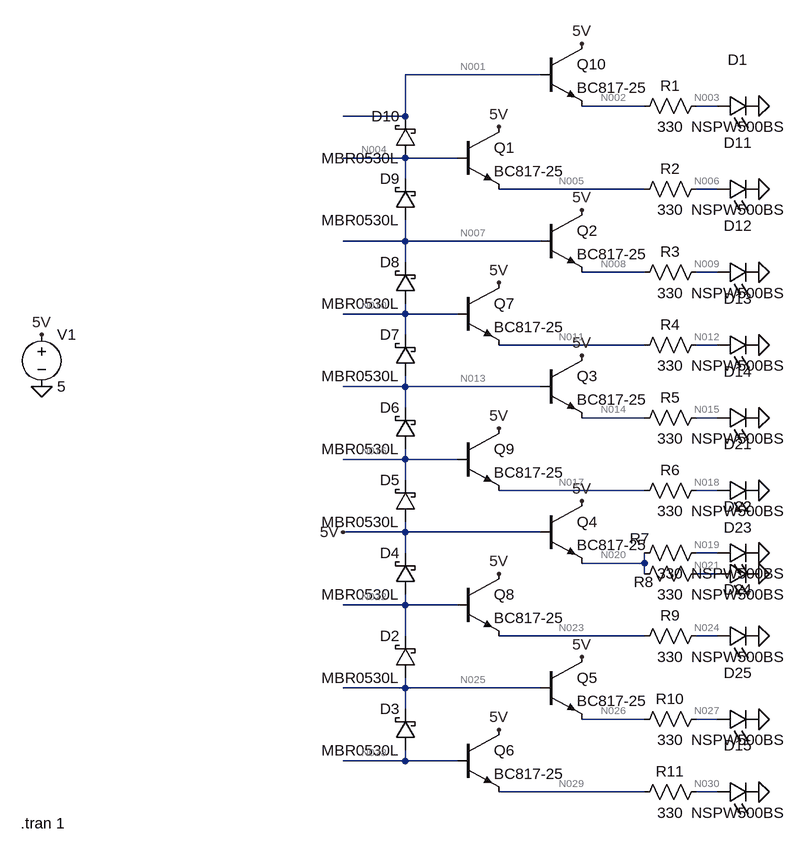
[diagram p0: schematic bargraph-bjt.asc]
bargraph-bjt.asc, the LTspice schematic file:
Version 4
SHEET 1 956 680
WIRE 448 -736 240 -736
WIRE 608 -688 512 -688
WIRE 720 -688 688 -688
WIRE 240 -672 240 -736
WIRE 240 -672 144 -672
WIRE 240 -608 144 -608
WIRE 320 -608 240 -608
WIRE 240 -576 240 -608
WIRE 608 -560 384 -560
WIRE 720 -560 688 -560
WIRE 240 -480 240 -512
WIRE 240 -480 144 -480
WIRE 448 -480 240 -480
WIRE 240 -448 240 -480
WIRE 608 -432 512 -432
WIRE 720 -432 688 -432
WIRE 240 -368 240 -384
WIRE 240 -368 144 -368
WIRE 320 -368 240 -368
WIRE 240 -336 240 -368
WIRE 608 -320 384 -320
WIRE 720 -320 688 -320
WIRE 240 -256 240 -272
WIRE 240 -256 144 -256
WIRE 448 -256 240 -256
WIRE 240 -224 240 -256
WIRE 608 -208 512 -208
WIRE 720 -208 688 -208
WIRE 240 -144 240 -160
WIRE 240 -144 144 -144
WIRE 320 -144 240 -144
WIRE 240 -112 240 -144
WIRE 608 -96 384 -96
WIRE 720 -96 688 -96
WIRE 240 -32 240 -48
WIRE 240 -32 144 -32
WIRE 448 -32 240 -32
WIRE 240 0 240 -32
WIRE 720 0 688 0
WIRE 608 16 608 0
WIRE 608 16 512 16
WIRE 608 32 608 16
WIRE 720 32 688 32
WIRE 240 80 240 64
WIRE 240 80 144 80
WIRE 320 80 240 80
WIRE 240 128 240 80
WIRE 608 128 384 128
WIRE 720 128 688 128
WIRE 240 208 240 192
WIRE 240 208 144 208
WIRE 448 208 240 208
WIRE 240 240 240 208
WIRE 608 256 512 256
WIRE 720 256 688 256
WIRE 240 320 240 304
WIRE 240 320 144 320
WIRE 320 320 240 320
WIRE 608 368 384 368
WIRE 720 368 688 368
FLAG 512 -784 5V
FLAG 384 -656 5V
FLAG 512 -528 5V
FLAG 384 -416 5V
FLAG 512 -304 5V
FLAG 384 -192 5V
FLAG 512 -80 5V
FLAG 384 32 5V
FLAG 512 160 5V
FLAG 384 272 5V
FLAG -320 -336 5V
FLAG -320 -256 0
FLAG 784 -688 0
FLAG 784 -560 0
FLAG 784 -432 0
FLAG 784 -320 0
FLAG 784 -208 0
FLAG 784 -96 0
FLAG 784 0 0
FLAG 784 32 0
FLAG 784 128 0
FLAG 784 256 0
FLAG 784 368 0
FLAG 144 -32 5V
SYMBOL schottky 256 64 R180
WINDOW 0 24 64 Left 2
WINDOW 3 24 0 Left 2
SYMATTR InstName D4
SYMATTR Value MBR0530L
SYMATTR Description Diode
SYMATTR Type diode
SYMBOL npn 320 -416 R0
SYMATTR InstName Q7
SYMATTR Value BC817-25
SYMBOL npn 448 -784 R0
SYMATTR InstName Q10
SYMATTR Value BC817-25
SYMBOL voltage -320 -352 R0
WINDOW 123 0 0 Left 0
WINDOW 39 0 0 Left 0
SYMATTR InstName V1
SYMATTR Value 5
SYMBOL res 704 -704 R90
WINDOW 0 0 56 VBottom 2
WINDOW 3 32 56 VTop 2
SYMATTR InstName R1
SYMATTR Value 330
SYMBOL res 704 -576 R90
WINDOW 0 0 56 VBottom 2
WINDOW 3 32 56 VTop 2
SYMATTR InstName R2
SYMATTR Value 330
SYMBOL res 704 -448 R90
WINDOW 0 0 56 VBottom 2
WINDOW 3 32 56 VTop 2
SYMATTR InstName R3
SYMATTR Value 330
SYMBOL res 704 -336 R90
WINDOW 0 0 56 VBottom 2
WINDOW 3 32 56 VTop 2
SYMATTR InstName R4
SYMATTR Value 330
SYMBOL res 704 -224 R90
WINDOW 0 0 56 VBottom 2
WINDOW 3 32 56 VTop 2
SYMATTR InstName R5
SYMATTR Value 330
SYMBOL res 704 -112 R90
WINDOW 0 0 56 VBottom 2
WINDOW 3 32 56 VTop 2
SYMATTR InstName R6
SYMATTR Value 330
SYMBOL res 704 -16 R90
WINDOW 0 9 103 VBottom 2
WINDOW 3 32 56 VTop 2
SYMATTR InstName R7
SYMATTR Value 330
SYMBOL res 704 16 R90
WINDOW 0 44 97 VBottom 2
WINDOW 3 32 56 VTop 2
SYMATTR InstName R8
SYMATTR Value 330
SYMBOL res 704 112 R90
WINDOW 0 0 56 VBottom 2
WINDOW 3 32 56 VTop 2
SYMATTR InstName R9
SYMATTR Value 330
SYMBOL res 704 240 R90
WINDOW 0 0 56 VBottom 2
WINDOW 3 32 56 VTop 2
SYMATTR InstName R10
SYMATTR Value 330
SYMBOL res 704 352 R90
WINDOW 0 0 56 VBottom 2
WINDOW 3 32 56 VTop 2
SYMATTR InstName R11
SYMATTR Value 330
SYMBOL LED 720 -672 R270
WINDOW 0 72 32 VTop 2
WINDOW 3 0 32 VBottom 2
SYMATTR InstName D1
SYMATTR Value NSPW500BS
SYMBOL LED 720 -544 R270
WINDOW 0 72 32 VTop 2
WINDOW 3 0 32 VBottom 2
SYMATTR InstName D11
SYMATTR Value NSPW500BS
SYMBOL LED 720 -416 R270
WINDOW 0 72 32 VTop 2
WINDOW 3 0 32 VBottom 2
SYMATTR InstName D12
SYMATTR Value NSPW500BS
SYMBOL LED 720 -304 R270
WINDOW 0 72 32 VTop 2
WINDOW 3 0 32 VBottom 2
SYMATTR InstName D13
SYMATTR Value NSPW500BS
SYMBOL LED 720 -192 R270
WINDOW 0 72 32 VTop 2
WINDOW 3 0 32 VBottom 2
SYMATTR InstName D14
SYMATTR Value NSPW500BS
SYMBOL LED 720 -80 R270
WINDOW 0 72 32 VTop 2
WINDOW 3 0 32 VBottom 2
SYMATTR InstName D21
SYMATTR Value NSPW500BS
SYMBOL LED 720 16 R270
WINDOW 0 72 32 VTop 2
WINDOW 3 0 32 VBottom 2
SYMATTR InstName D22
SYMATTR Value NSPW500BS
SYMBOL LED 720 48 R270
WINDOW 0 72 32 VTop 2
WINDOW 3 0 32 VBottom 2
SYMATTR InstName D23
SYMATTR Value NSPW500BS
SYMBOL LED 720 144 R270
WINDOW 0 72 32 VTop 2
WINDOW 3 0 32 VBottom 2
SYMATTR InstName D24
SYMATTR Value NSPW500BS
SYMBOL LED 720 272 R270
WINDOW 0 72 32 VTop 2
WINDOW 3 0 32 VBottom 2
SYMATTR InstName D25
SYMATTR Value NSPW500BS
SYMBOL LED 720 384 R270
WINDOW 0 72 32 VTop 2
WINDOW 3 0 32 VBottom 2
SYMATTR InstName D15
SYMATTR Value NSPW500BS
SYMBOL npn 320 -656 R0
SYMATTR InstName Q1
SYMATTR Value BC817-25
SYMBOL npn 448 -528 R0
SYMATTR InstName Q2
SYMATTR Value BC817-25
SYMBOL npn 448 -304 R0
SYMATTR InstName Q3
SYMATTR Value BC817-25
SYMBOL npn 448 -80 R0
SYMATTR InstName Q4
SYMATTR Value BC817-25
SYMBOL npn 448 160 R0
SYMATTR InstName Q5
SYMATTR Value BC817-25
SYMBOL npn 320 272 R0
SYMATTR InstName Q6
SYMATTR Value BC817-25
SYMBOL npn 320 32 R0
SYMATTR InstName Q8
SYMATTR Value BC817-25
SYMBOL npn 320 -192 R0
SYMATTR InstName Q9
SYMATTR Value BC817-25
SYMBOL schottky 256 192 R180
WINDOW 0 24 64 Left 2
WINDOW 3 24 0 Left 2
SYMATTR InstName D2
SYMATTR Value MBR0530L
SYMATTR Description Diode
SYMATTR Type diode
SYMBOL schottky 256 304 R180
WINDOW 0 24 64 Left 2
WINDOW 3 24 0 Left 2
SYMATTR InstName D3
SYMATTR Value MBR0530L
SYMATTR Description Diode
SYMATTR Type diode
SYMBOL schottky 256 -48 R180
WINDOW 0 24 64 Left 2
WINDOW 3 24 0 Left 2
SYMATTR InstName D5
SYMATTR Value MBR0530L
SYMATTR Description Diode
SYMATTR Type diode
SYMBOL schottky 256 -160 R180
WINDOW 0 24 64 Left 2
WINDOW 3 24 0 Left 2
SYMATTR InstName D6
SYMATTR Value MBR0530L
SYMATTR Description Diode
SYMATTR Type diode
SYMBOL schottky 256 -272 R180
WINDOW 0 24 64 Left 2
WINDOW 3 24 0 Left 2
SYMATTR InstName D7
SYMATTR Value MBR0530L
SYMATTR Description Diode
SYMATTR Type diode
SYMBOL schottky 256 -384 R180
WINDOW 0 24 64 Left 2
WINDOW 3 24 0 Left 2
SYMATTR InstName D8
SYMATTR Value MBR0530L
SYMATTR Description Diode
SYMATTR Type diode
SYMBOL schottky 256 -512 R180
WINDOW 0 24 64 Left 2
WINDOW 3 24 0 Left 2
SYMATTR InstName D9
SYMATTR Value MBR0530L
SYMATTR Description Diode
SYMATTR Type diode
SYMBOL schottky 256 -608 R180
WINDOW 0 24 64 Left 2
WINDOW 3 24 0 Left 2
SYMATTR InstName D10
SYMATTR Value MBR0530L
SYMATTR Description Diode
SYMATTR Type diode
TEXT -352 416 Left 2 !.tran 1

The netlist it stands for:
* bargraph-bjt.asc
D4 N022 5V MBR0530L
Q7 5V N010 N011 0 BC817-25
Q10 5V N001 N002 0 BC817-25
V1 5V 0 5
R1 N003 N002 330
R2 N006 N005 330
R3 N009 N008 330
R4 N012 N011 330
R5 N015 N014 330
R6 N018 N017 330
R7 N019 N020 330
R8 N021 N020 330
R9 N024 N023 330
R10 N027 N026 330
R11 N030 N029 330
D1 N003 0 NSPW500BS
D11 N006 0 NSPW500BS
D12 N009 0 NSPW500BS
D13 N012 0 NSPW500BS
D14 N015 0 NSPW500BS
D21 N018 0 NSPW500BS
D22 N019 0 NSPW500BS
D23 N021 0 NSPW500BS
D24 N024 0 NSPW500BS
D25 N027 0 NSPW500BS
D15 N030 0 NSPW500BS
Q1 5V N004 N005 0 BC817-25
Q2 5V N007 N008 0 BC817-25
Q3 5V N013 N014 0 BC817-25
Q4 5V 5V N020 0 BC817-25
Q5 5V N025 N026 0 BC817-25
Q6 5V N028 N029 0 BC817-25
Q8 5V N022 N023 0 BC817-25
Q9 5V N016 N017 0 BC817-25
D2 N025 N022 MBR0530L
D3 N028 N025 MBR0530L
D5 5V N016 MBR0530L
D6 N016 N013 MBR0530L
D7 N013 N010 MBR0530L
D8 N010 N007 MBR0530L
D9 N007 N004 MBR0530L
D10 N004 N001 MBR0530L
.model D D
.lib standard.dio
.model NPN NPN
.model PNP PNP
.lib standard.bjt
.tran 1
.backanno
.end

* Results of the author's LTspice run, read from the files saved beside the schematic
* Operating Point, zero values left out:
*   V(n022) = 2.985 V
*   V(5v) = 5 V
*   V(n010) = 4.706 V
*   V(n011) = 4.072 V
*   V(n001) = 4.497 V
*   V(n002) = 3.867 V
*   V(n003) = 2.868 V
*   V(n006) = 2.876 V
*   V(n005) = 3.92 V
*   V(n009) = 2.887 V
*   V(n008) = 3.99 V
*   V(n012) = 2.899 V
*   V(n015) = 2.912 V
*   V(n014) = 4.162 V
*   V(n018) = 2.924 V
*   V(n017) = 4.258 V
*   V(n019) = 2.935 V
*   V(n020) = 4.342 V
*   V(n021) = 2.935 V
*   V(n024) = 2.366 V
*   V(n023) = 2.429 V
*   V(n027) = 2.347 V
*   V(n026) = 2.403 V
*   V(n030) = 2.34 V
*   V(n029) = 2.394 V
*   V(n004) = 4.551 V
*   V(n007) = 4.623 V
*   V(n013) = 4.797 V
*   V(n025) = 2.957 V
*   V(n028) = 2.946 V
*   V(n016) = 4.896 V
*   Ic(Q9) = 4.03 mA
*   Ib(Q9) = 12.3 µA
*   Ie(Q9) = -4.042 mA
*   Ic(Q8) = 189.5 µA
*   Ib(Q8) = 561.9 nA
*   Ie(Q8) = -190.1 µA
*   Ic(Q6) = 163.4 µA
*   Ib(Q6) = 484 nA
*   Ie(Q6) = -163.9 µA
*   Ic(Q5) = 170.1 µA
*   Ib(Q5) = 504.1 nA
*   Ie(Q5) = -170.6 µA
*   Ic(Q4) = 8.501 mA
*   Ib(Q4) = 26.23 µA
*   Ie(Q4) = -8.527 mA
*   Ic(Q3) = 3.777 mA
*   Ib(Q3) = 11.51 µA
*   Ie(Q3) = -3.788 mA
*   Ic(Q2) = 3.333 mA
*   Ib(Q2) = 10.13 µA
*   Ie(Q2) = -3.343 mA
*   Ic(Q1) = 3.154 mA
*   Ib(Q1) = 9.572 µA
*   Ie(Q1) = -3.163 mA
*   Ic(Q10) = 3.02 mA
*   Ib(Q10) = 9.157 µA
*   Ie(Q10) = -3.029 mA
*   Ic(Q7) = 3.543 mA
*   Ib(Q7) = 10.78 µA
*   Ie(Q7) = -3.554 mA
*   I(D15) = 163.9 µA
*   I(D25) = 170.6 µA
*   I(D24) = 190.1 µA
*   I(D23) = 4.263 mA
*   I(D22) = 4.263 mA
*   I(D21) = 4.042 mA
*   I(D14) = 3.788 mA
*   I(D13) = 3.554 mA
*   I(D12) = 3.343 mA
*   I(D11) = 3.163 mA
*   I(D1) = 3.029 mA
*   I(D10) = 9.157 µA
*   I(D9) = 18.73 µA
*   I(D8) = 28.86 µA
*   I(D7) = 39.64 µA
*   I(D6) = 51.14 µA
*   I(D5) = 63.44 µA
*   I(D3) = -484 nA
*   I(D2) = -988.2 nA
*   I(D4) = -1.55 µA
*   I(R11) = -163.9 µA
*   I(R10) = -170.6 µA
*   I(R9) = -190.1 µA
*   I(R8) = -4.263 mA
*   I(R7) = -4.263 mA
*   I(R6) = -4.042 mA
*   I(R5) = -3.788 mA
*   I(R4) = -3.554 mA
*   I(R3) = -3.343 mA
*   I(R2) = -3.163 mA
*   I(R1) = -3.029 mA
*   I(V1) = -29.97 mA